# Altium project 起跑突击V4.0.PrjPCB
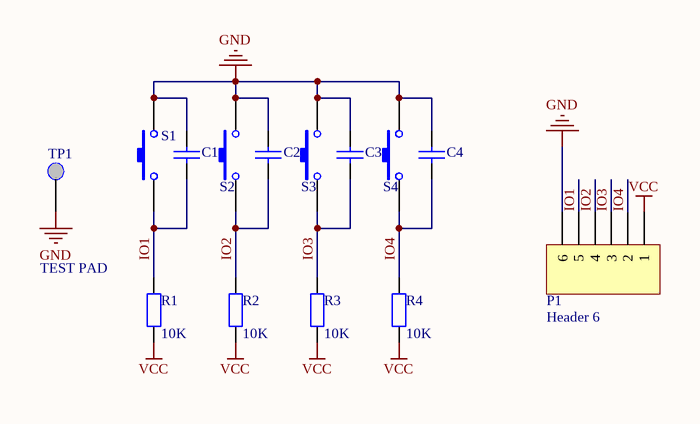
[diagram p0: 起跑突击V4.0.SchDoc]
1 sheet, 14 parts. Net scope: global (net labels, ports and power ports of the same name join across sheets).
Board files: 起跑突击V4.0.PcbDoc, 起跑突击V4.1.PcbDoc, 起跑突击V4.2.PcbDoc, 起跑V4.3.PcbDoc

## Sheet 起跑突击V4.0.SchDoc
size A4

### Parts
C1  Cap  [C2012]  (value not drawn)
C2  Cap  [C2012]  (value not drawn)
C3  Cap  [C2012]  (value not drawn)
C4  Cap  [C2012]  (value not drawn)
P1  Header 6  [HDR1X6]
R1  value 10K  [R2012]  (hidden comment: Res2)
R2  value 10K  [R2012]  (hidden comment: Res2)
R3  value 10K  [R2012]  (hidden comment: Res2)
R4  value 10K  [R2012]  (hidden comment: Res2)
S1  SW-PB  [AXIAL-1.0]  (value not drawn)
S2  SW-PB  [AXIAL-1.0]  (value not drawn)
S3  SW-PB  [AXIAL-1.0]  (value not drawn)
S4  SW-PB  [AXIAL-1.0]  (value not drawn)
TP1  TEST PAD  [PIN]

### Nets
GND: C1.2 C2.2 C3.2 C4.2 P1.6 S1.2 S2.2 S3.2 S4.2 TP1.1
VCC: P1.1 R1.2 R2.2 R3.2 R4.2
IO1: C1.1 P1.5 R1.1 S1.1
IO2: C2.1 P1.4 R2.1 S2.1
IO3: C3.1 P1.3 R3.1 S3.1
IO4: C4.1 P1.2 R4.1 S4.1

### Library data of the parts
C1-C4 = Cap: 贴片电容; Value: 100pF; Published: 8-Jun-2000; LatestRevisionDate: 17-Jul-2002; LatestRevisionNote: Re-released for DXP Platform.; PackageReference: RAD-0.3; Publisher: Altium Limited
P1 = Header 6: Header, 6-Pin; LatestRevisionDate: 17-Jul-2002; LatestRevisionNote: Re-released for DXP Platform.; Publisher: Altium Limited
R1-R4 = Res2: Resistor; Published: 8-Jun-2000; LatestRevisionDate: 17-Jul-2002; LatestRevisionNote: Re-released for DXP Platform.; PackageReference: AXIAL-0.4; Publisher: Altium Limited; PackageDescription: Axial Device, Thru-Hole; 2 Leads; 0.4 in Pin Spacing
S1-S4 = SW-PB: Switch; Published: 24-Mar-1999; LatestRevisionDate: 17-Jul-2002; LatestRevisionNote: Re-released for DXP Platform.; PackageReference: SPST-2; Publisher: Altium Limited